# Altium schematic sheet McuMemory.SchDoc
size A4; DocumentNumber: 2; SheetNumber: 2; SheetTotal: 2; Address1: L3, 12a Rodborough Rd; Address2: Frenchs Forest; Address3: NSW; Address4: Australia 2086; Organization: Altium Limited
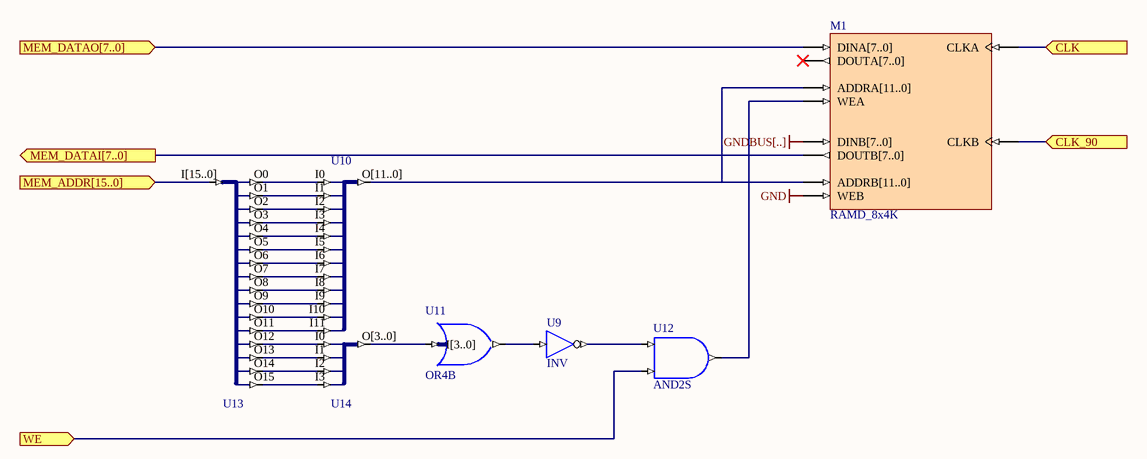
[diagram p0: McuMemory.SchDoc]

## Parts
M1  RAMD_8x4K
U9  INV
U10  J12S_12B  (value not drawn)
U11  OR4B
U12  AND2S
U13  J16B_16S  (value not drawn)
U14  J4S_4B  (value not drawn)

## Ports
CLK (in), CLK_90 (in), MEM_ADDR[15..0] (in), MEM_DATAI[7..0] (out), MEM_DATAO[7..0] (in), WE (in)

## Nets
GND: M1.WEB
GNDBUS[..]: M1.DINB[7..0]
CLK: M1.CLKA ; port CLK
CLK_90: M1.CLKB ; port CLK_90
MEM_ADDR[15..0]: U13.I[15..0] ; port MEM_ADDR[15..0]
MEM_DATAI[7..0]: M1.DOUTB[7..0] ; port MEM_DATAI[7..0]
MEM_DATAO[7..0]: M1.DINA[7..0] ; port MEM_DATAO[7..0]
WE: U12.I1 ; port WE
NetM1_ADDRA[11..0]: M1.ADDRA[11..0] M1.ADDRB[11..0] U10.O[11..0]
NetM1_WEA: M1.WEA U12.O
NetU9_I: U9.I U11.O
NetU9_O: U9.O U12.I0
NetU10_I0: U10.I0 U13.O0
NetU10_I1: U10.I1 U13.O1
NetU10_I2: U10.I2 U13.O2
NetU10_I3: U10.I3 U13.O3
NetU10_I4: U10.I4 U13.O4
NetU10_I5: U10.I5 U13.O5
NetU10_I6: U10.I6 U13.O6
NetU10_I7: U10.I7 U13.O7
NetU10_I8: U10.I8 U13.O8
NetU10_I9: U10.I9 U13.O9
NetU10_I10: U10.I10 U13.O10
NetU10_I11: U10.I11 U13.O11
NetU11_I[3..0]: U11.I[3..0] U14.O[3..0]
NetU13_O12: U13.O12 U14.I0
NetU13_O13: U13.O13 U14.I1
NetU13_O14: U13.O14 U14.I2
NetU13_O15: U13.O15 U14.I3

Not connected (* = marked no-connect by the designer): M1 DOUTA[7..0]*

## Notes on the sheet
- Title
- Size:
- Date:
- A4
- Number:
- Time:
- Revision:
- Sheet
- of
- File:

## Library data of the parts
M1 = RAMD_8x4K: Dual Port Random Access Memory; Memory_DepthA: 4096; Memory_Type: RAM_DualPortBlock; Memory_WidthA: 8; Memory_ClockEdge: Rising; Nexus_Core: Memory_Program; Published: 13/01/2004; Publisher: Altium Hobart Technology Center; Memory_DepthB: 4096; Memory_WidthB: 8
U9 = INV: Inverter; ArchiveName: GENERIC; VHDLIB_SIM: GENERIC_LIB; Published: 29-Jan-2004; Publisher: Altium Limited; Xilinx Equivalent: INV; Core Revision: 1.00.00
U10 = J12S_12B: 12 Single pin inputs to single 12-Bit output bus; Functional Class: Bus Joiner; Port Size: 12; ArchiveName: GENERIC; VHDLIB_SIM: GENERIC_LIB; Published: 29-Jan-2004; Publisher: Altium Limited; Core Revision: 1.00.00; HelpURL: CR0118 FPGA Generic Library Guide.pdf#page=305
U11 = OR4B: 4-Input OR Gate, Bus Version; ArchiveName: GENERIC; VHDLIB_SIM: GENERIC_LIB; Published: 29-Jan-2004; Publisher: Altium Limited; Core Revision: 1.00.00
U12 = AND2S: 2-Input AND Gate, Single Pin Version; Xilinx Equivalent: AND2; ArchiveName: GENERIC; VHDLIB_SIM: GENERIC_LIB; Published: 29-Jan-2004; Publisher: Altium Limited; Core Revision: 1.00.00
U13 = J16B_16S: Single 16-Bit input bus to 16 single pin outputs; Functional Class: Bus Joiner; Port Size: 16; ArchiveName: GENERIC; VHDLIB_SIM: GENERIC_LIB; Published: 29-Jan-2004; Publisher: Altium Limited; Core Revision: 1.00.00; HelpURL: CR0118 FPGA Generic Library Guide.pdf#page=303
U14 = J4S_4B: 4 Single pin inputs to single 4-Bit output bus; Functional Class: Bus Joiner; Port Size: 4; ArchiveName: GENERIC; VHDLIB_SIM: GENERIC_LIB; Published: 29-Jan-2004; Publisher: Altium Limited; Core Revision: 1.00.00; HelpURL: CR0118 FPGA Generic Library Guide.pdf#page=305